# EAGLE design oc (EAGLE 7.2.0)
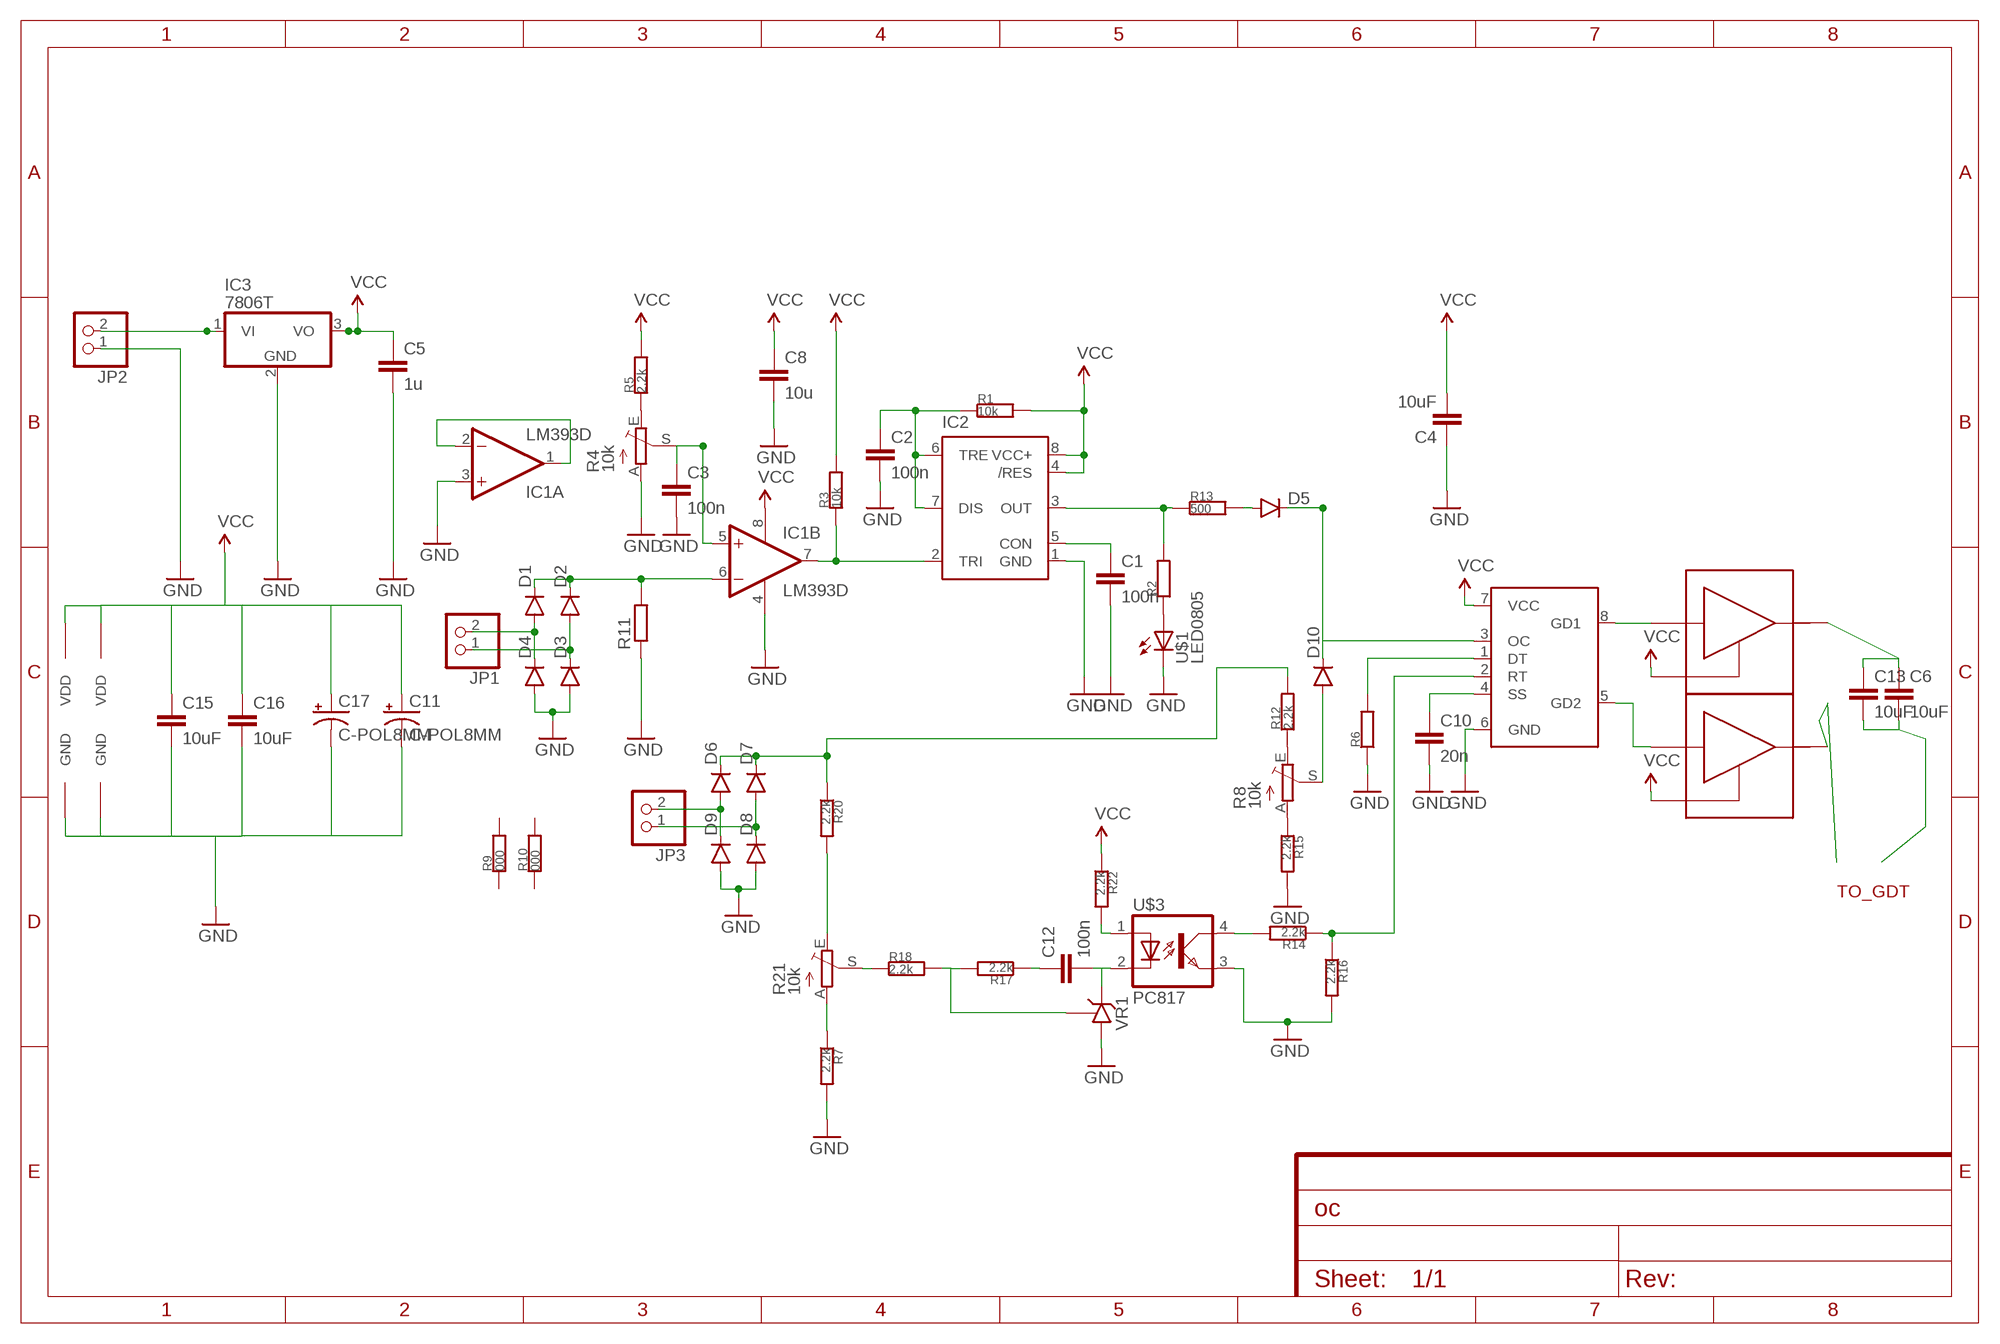
[diagram p0: schematic, sheet 1]

## Parts
C1  100n  CC0805  [C0805]
C2  100n  CC0805  [C0805]
C3  100n  CC0603  [C0603]
C4  10uF  10UF50V20%(1210)  [1210]
C5  1u  CC0805  [C0805]
C6  10uF  10UF50V20%(1210)  [1210]
C8  10u  CC0805  [C0805]
C10  20n  CC0805  [C0805]
C11  C-POL8MM  [PCAP8]
C12  100n  CC0805  [C0805]
C13  10uF  10UF50V20%(1210)  [1210]
C15  10uF  10UF50V20%(1210)  [1210]
C16  10uF  10UF50V20%(1210)  [1210]
C17  C-POL8MM  [PCAP8]
D1  PMLL4150  [SOD80C]
D2  PMLL4150  [SOD80C]
D3  PMLL4150  [SOD80C]
D4  PMLL4150  [SOD80C]
D5  PMLL4150  [SOD80C]
D6  PMLL4150  [SOD80C]
D7  PMLL4150  [SOD80C]
D8  PMLL4150  [SOD80C]
D9  PMLL4150  [SOD80C]
D10  PMLL4150  [SOD80C]
IC1  LM393D  [SO08]
IC2  NE555D  [SO08]
IC3  7806T  [TO220H]
JP1  PINHD-1X2  [1X02]
JP2  PINHD-1X2  [1X02]
JP3  PINHD-1X2  [1X02]
R1  10k  R0805  [R0805]
R2  R0805  [R0805]
R3  10k  R0805  [R0805]
R4  10k  TRIM_EU-RJ9W  [RJ9W]
R5  2.2k  R0805  [R0805]
R6  R0805  [R0805]
R7  2.2k  R0805  [R0805]
R8  10k  TRIM_EU-RJ9W  [RJ9W]
R9  000  R1206  [R1206]
R10  000  R0805  [R0805]
R11  R-EU_0617/17  [0617/17]
R12  2.2k  R0805  [R0805]
R13  500  R0805  [R0805]
R14  2.2k  R0805  [R0805]
R15  2.2k  R0805  [R0805]
R16  2.2k  R0805  [R0805]
R17  2.2k  R0805  [R0805]
R18  2.2k  R0805  [R0805]
R20  2.2k  R0805  [R0805]
R21  10k  TRIM_EU-RJ9W  [RJ9W]
R22  2.2k  R0805  [R0805]
U$1  LED0805  [0805-LED]
U$2  TPS92020  [SO08]
U$3  PC817  [DIL4-SMD]
U$7  IXDD614  [DPACK-5]
U$8  IXDD614  [DPACK-5]
VR1  TL431CLPSO8  [SO08]

## Nets
GND: C1.2 C2.2 C3.2 C4.1 C5.2 C8.2 C10.2 C11.P$2(-) C15.2 C16.2 C17.P$2(-) D3.A D4.A D8.A D9.A IC1.3(A:+IN) IC1.4(P:V-) IC2.1(GND) IC3.2(GND) JP2.1 R4.A R6.1 R7.2 R11.1 R15.2 R16.2 U$1.C U$2.6(GND) U$3.3(EMIT) U$7.3(GND) U$7.6(GND) U$8.3(GND) U$8.6(GND) VR1.2(A) VR1.3(A) VR1.6(A) VR1.7(A)
N$1: D1.C D2.C IC1.6(B:-IN) R11.2
N$2: U$2.8(GD1) U$8.4(IN)
N$3: C1.1 IC2.5(CON)
N$4: D5.C D10.C U$2.3(OC)
N$5: C2.1 IC2.6(TRE) IC2.7(DIS) R1.1
N$6: IC2.3(OUT) R2.2 R13.1
N$7: R2.1 U$1.A
N$8: IC1.7(B:OUT) IC2.2(TRI) R3.1
N$9: R4.E R5.1
N$10: C3.1 IC1.5(B:+IN) R4.S
N$11: IC1.1(A:OUT) IC1.2(A:-IN)
N$12: D2.A D3.C JP1.1
N$13: D1.A D4.C JP1.2
N$14: IC3.1(VI) JP2.2
N$15: U$2.5(GD2) U$7.4(IN)
N$16: D5.A R13.2
N$17: R8.E R12.1
N$18: C10.1 U$2.4(SS)
N$19: R6.2 U$2.1(DT)
N$20: R14.1 R16.1 U$2.2(RT)
N$21: R14.2 U$3.4(COL)
N$22: C6.1 C13.1 U$8.2(OUT)
N$23: U$7.2(OUT)
N$24: C6.2 C13.2
N$25: D6.C D7.C R12.2 R20.1
N$26: C12.2 U$3.2(C) VR1.1(C)
N$27: R17.2 R18.2 VR1.8(R)
N$28: C12.1 R17.1
N$29: R18.1 R21.S
N$30: R20.2 R21.E
N$31: D10.A R8.S
N$32: R22.2 U$3.1(A)
N$33: D7.A D8.C JP3.1
N$34: D6.A D9.C JP3.2
N$36: R8.A R15.1
N$37: R7.1 R21.A
VCC: C4.2 C5.1 C8.1 C11.P$1(+) C15.1 C16.1 C17.P$1(+) IC1.8(P:V+) IC2.4(/RES) IC2.8(VCC+) IC3.3(VO) R1.2 R3.2 R5.2 R22.1 U$2.7(VCC) U$7.1(VDD) U$7.5(EN) U$8.1(VDD) U$8.5(EN)
Unconnected: R9.1 R9.2 R10.1 R10.2

## Notes on the sheet
- TO_GDT

## Library data of the parts
C1-C3 C5 C8 C10 C12 = CasaLibrary:C: Capacitor
C4 C6 C13 C15 C16 = SparkFun-Capacitors:10UF50V20%(1210): CAP-09824; PROD_ID: CAP-09824
C11 C17 = CasaLibrary:C-POL
D1-D10 = DIODE:PMLL4150
IC1 = linear:LM393: COMPARATOR
IC2 = SparkFun-AnalogIC:NE555: General purpose bipolar Timer
IC3 = linear:78*: Positive VOLTAGE REGULATOR Source: http://cache.national.com/ds/LM/LM78L05.pdf http://www.fairchildsemi.com/ds/LM/LM7805.pdf
JP1-JP3 = pinhead:PINHD-1X2: PIN HEADER
R1-R3 R5-R7 R9 R10 R12-R18 R20 R22 = CasaLibrary:R
R4 R8 R21 = pot:TRIM_EU-: POTENTIOMETER
R11 = rcl:R-EU_: RESISTOR, European symbol
U$1 = CasaLibrary:LED
U$2 = CasaLibrary:TPS92020
U$3 = CasaLibrary:PC817
U$7 U$8 = CasaLibrary:IXDD614
VR1 = CasaLibrary:TL431CLP: VOLTAGE REGULATOR

## Board
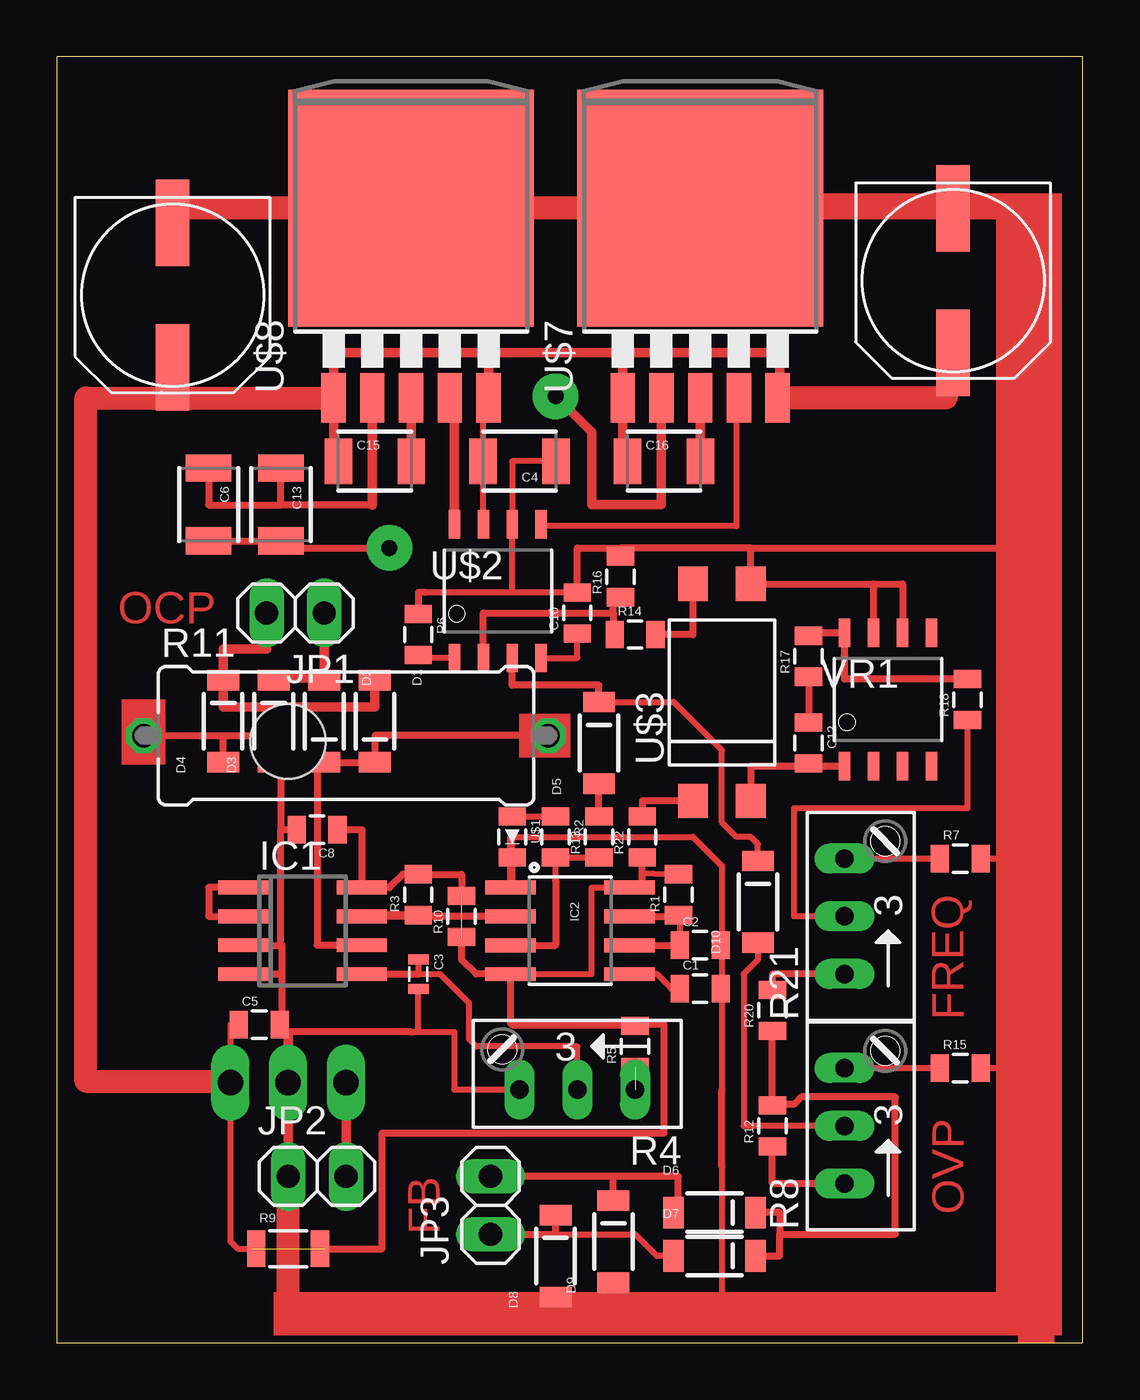
[diagram p1: board, top side]
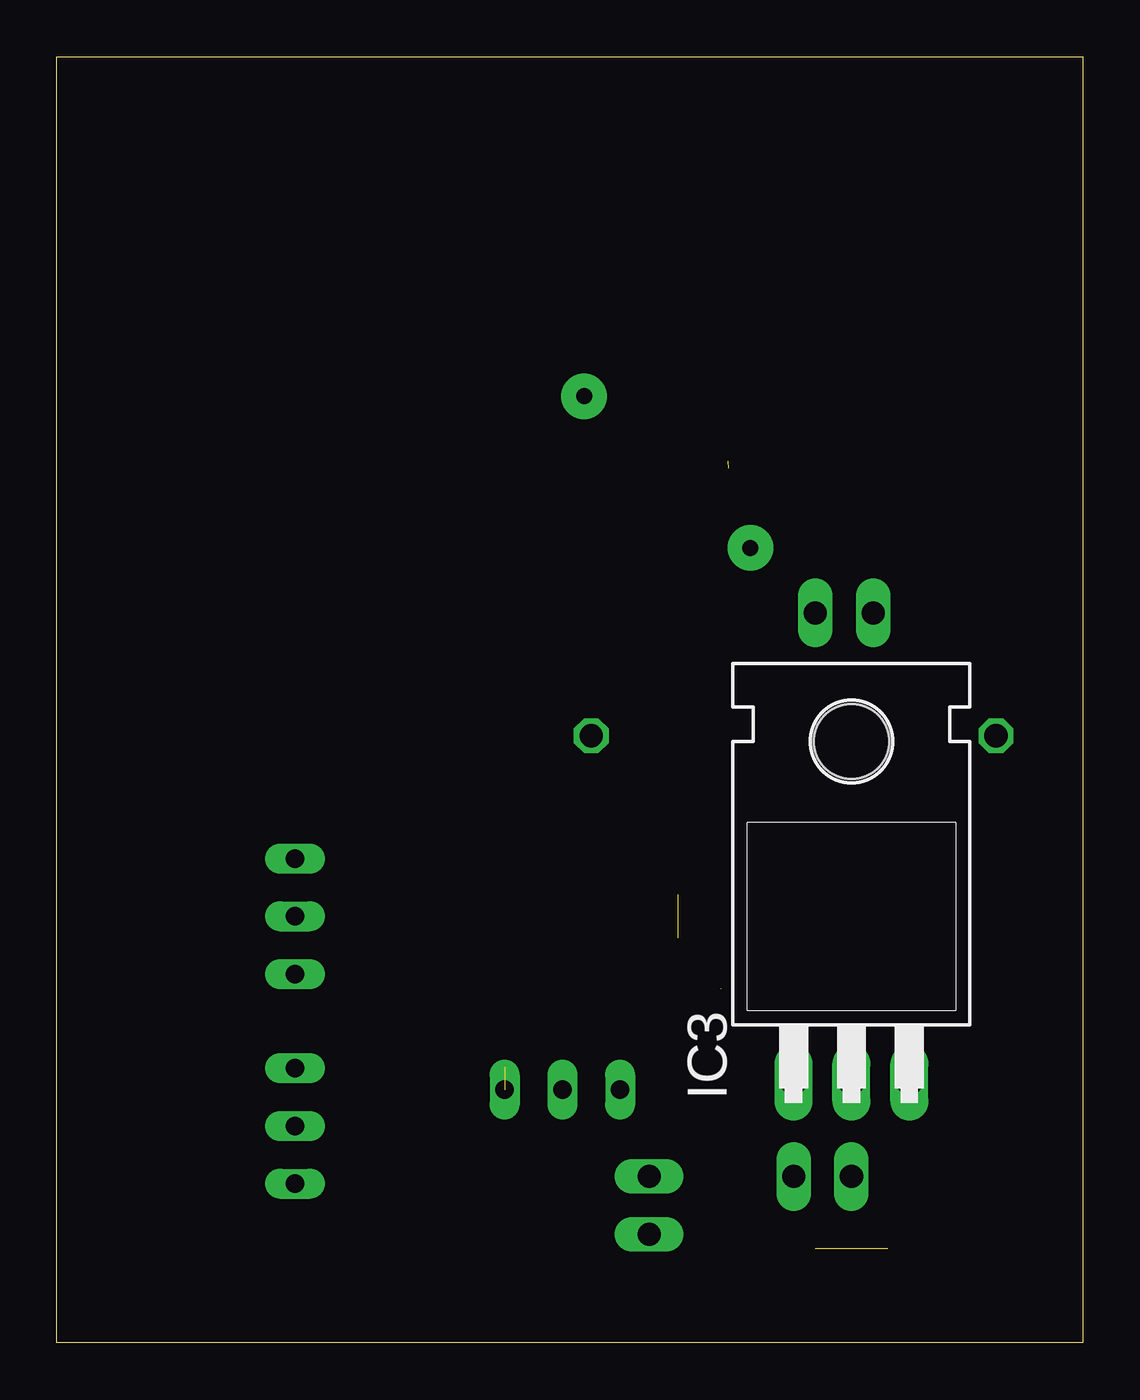
[diagram p2: board, bottom side, seen from below]

Size 45.06 x 56.5 mm. Coordinates in mm from the lower left corner, seen from the top.
Outline: 0,0 45.06,0 45.06,56.5 0,56.5 0,0
Copper layers (1*16): Top 0.035mm / dielectric 1.5mm / Bottom 0.035mm
Design rules "default": minimum track width 0.2mm, minimum drill 0.2mm, track to track 0.2mm, track to pad 0.2mm, pad to pad 0.2mm, via to via 0.2mm, smd to smd 0.2mm, copper to edge 0.2mm, drill to drill 0.2mm, minimum pad ring 10mil, minimum via ring 8mil, stop-mask expansion 4mil, vias tented up to drill 0mil, thermal gap 10mil

### Footprints (pad centres in the part's own frame; a part is rotated, then mirrored left to right if it is on the bottom)
C0805 = smd 0.8 x 1.2: 1 -0.9,0; 2 0.9,0
C0603 = smd 0.45 x 0.9: 1 -0.65,0; 2 0.65,0
1210 = smd 1.2 x 2: 1 -1.6,0; 2 1.6,0
PCAP8 = smd 3.8 x 1.46: P$1 -3.175,0; P$2 3.175,0
SOD80C = smd 0.9 x 1.4: A -1.8,0; C 1.8,0
SO08 = smd 0.6 x 2.2: 1 -1.905,-2.6; 2 -0.635,-2.6; 3 0.635,-2.6; 4 1.905,-2.6; 5 1.905,2.6; 6 0.635,2.6; 7 -0.635,2.6; 8 -1.905,2.6
SO08' = smd 0.61 x 2.21: 1 -1.905,-2.616; 2 -0.635,-2.616; 3 0.635,-2.616; 4 1.905,-2.616; 5 1.905,2.616; 6 0.635,2.616; 7 -0.635,2.616; 8 -1.905,2.616
TO220H = drill 1.118 long: 1 -2.54,-10.16; 2 0,-10.16; 3 2.54,-10.16 | hole 3.302: 0,4.826
1X02 = drill 1.016 long: 1 -1.27,0; 2 1.27,0
R0805 = smd 0.8 x 1.2: 1 -0.9,0; 2 0.9,0
RJ9W = drill 0.813 long: A 2.54,0.635; E -2.54,0.635; S 0,0.635
R1206 = smd 0.8 x 1.6: 1 -1.4,0; 2 1.4,0
0617/17 = drill 1.016 octagon: 1 -8.89,0; 2 8.89,0
0805-LED = smd 0.8 x 1.2: A -0.9,0; C 0.9,0
SO08'' = smd 0.5 x 1.25: 1 -1.905,-2.934; 2 -0.635,-2.934; 3 0.635,-2.934; 4 1.905,-2.934; 5 1.905,2.934; 6 0.635,2.934; 7 -0.635,2.934; 8 -1.905,2.934
DIL4-SMD = smd 1.3 x 1.5: 1 -1.27,-4.77; 2 1.27,-4.77; 3 1.27,4.77; 4 -1.27,4.77
DPACK-5 = smd 1.067 x 2.159: 1 -3.404,-8.331; 2 -1.702,-8.331; 3 0,-8.331; 4 1.702,-8.331; 5 3.404,-8.331 | smd 10.8 x 10.41: 6 0,0

### Placement (x,y rotation side)
C1  28.26,15.56 0 top
C2  28.26,17.46 0 top
C3  15.88,16.19 270 top
C4  20.32,38.73 180 top
C5  8.89,13.97 0 top
C6  6.67,36.83 270 top
C8  11.43,22.54 180 top
C10  22.86,32.07 90 top
C11  39.37,46.67 90 top
C12  33.02,26.35 270 top
C13  9.84,36.83 270 top
C15  13.97,38.73 0 top
C16  26.67,38.73 0 top
C17  5.08,46.04 90 top
D1  13.97,27.3 270 top
D2  11.75,27.3 270 top
D3  9.53,27.3 90 top
D4  7.3,27.3 90 top
D5  23.81,26.35 90 top
D6  28.89,5.71 0 top
D7  28.89,3.81 0 top
D8  21.91,3.81 90 top
D9  24.45,4.45 90 top
D10  30.8,19.37 90 top
IC1  10.79,18.1 270 top
IC2  [SO08']  22.54,18.1 270 top
IC3  10.16,21.59 0 bottom
JP1  10.48,32.07 180 top
JP2  11.43,7.3 0 top
JP3  19.05,6.03 90 top
R1  27.3,19.68 90 top
R2  21.91,22.23 270 top
R3  15.88,19.68 90 top
R4  22.86,11.75 180 top
R5  25.4,13.02 90 top
R6  15.88,31.11 270 top
R7  39.69,21.27 0 top
R8  35.24,9.53 90 top
R9  10.16,4.13 0 top
R10  17.78,18.73 90 top
R11  12.7,26.67 0 top
R12  31.43,9.53 90 top
R13  23.81,22.23 90 top
R14  25.4,31.11 0 top
R15  39.69,12.06 0 top
R16  24.77,33.66 90 top
R17  33.02,30.16 90 top
R18  40.01,28.26 90 top
R20  31.43,14.61 90 top
R21  35.24,18.73 90 top
R22  25.72,22.23 90 top
U$1  20,22.23 270 top
U$2  TPS92020  [SO08'']  19.37,33.02 0 top
U$3  29.21,28.57 0 top
U$4  [A5P-LOC]  -20.64,124.14 0 top  (outside the outline)
U$7  28.26,49.85 0 top
U$8  15.56,49.85 0 top
VR1  [SO08'']  36.51,28.26 0 top

### Tracks (layer width: path | path; a pad name or v marks a point on that pad's centre or on a via)
GND  (2 unrouted)
  Top 0.254: U$1.C 20,22.23 | 20,22.23 19.93,22.23 IC2.1 | R4.A 17.45,11.11 17.46,11.13 17.46,13.65 15.88,13.65 | 15.88,13.65 15.56,13.65 9.84,13.65 9.84,13.97 C5.2 | 15.88,13.65 15.88,15.56 | 15.89,32 R6.1 | C10.2 20,32.97 | 20,32.97 U$2.6 20,38.73 C4.1 | 20,32.97 16.2,32.97 | 29.21,15.56 29.21,17.46 C2.2 29.21,17.52 29.21,20.95 27.94,22.23 20,22.23 | 29.21,15.56 29.21,11.11 | 29.21,7.72 29.21,1.59 | C1.2 29.21,15.56 | R15.2 41.91,12.06 | R7.2 41.91,21.27 41.91,20.95
  Top 0.305: IC1.4 9.89,16.19 | 9.89,16.19 9.89,17.46 9.84,17.46 | 9.89,16.19 9.89,13.65 15.56,13.65 | IC1.3 9.84,17.46 | 9.84,22.54 C8.2 | 9.84,17.46 9.84,22.54 | D4.A 7.3,26.67 | 7.3,26.67 9.53,26.67 D3.A 9.84,25.5 9.84,22.54 | IC2.1 20,20 U$1.C | R11.1 7.3,26.67 | C10.2 22.86,34.92 24.77,34.92 | 24.77,34.92 R16.2 | 30.48,34.92 U$3.3 35.88,33.34 | 30.48,34.92 24.77,34.92 | 30.48,34.92 41.91,34.92 | 35.88,33.34 37.15,33.34 VR1.6 | VR1.7 35.88,33.34 | 42.23,12.06 42.23,1.59 | 16.2,32.97 15.88,32.97 R6.1 | 29.21,7.72 29.21,11.11 | D8.A 24.45,1.59 D9.A
  Top 0.406: C17.P$2 5.08,49.85 U$8.6 U$7.6 | 15.56,38.43 U$8.3 | C16.2 arc-90 28.26,38.75 U$7.3 | JP2.1 IC3.2 10.16,13.6 C5.2
  Top 1.016: 5.08,49.85 U$7.6 C11.P$2 41.91,49.85 41.91,34.92 41.91,20.95 41.91,12.06 42.23,1.59 29.21,1.59 24.45,1.59 10.16,1.59 JP2.1
N$1
  Top 0.305: IC1.6 11.43,17.46 11.43,25.5 D2.C D1.C 13.97,26.67 R11.2
N$2
  Top 0.406: U$2.8 17.46,41.52 U$8.4
N$3
  Top 0.254: C1.1 26.99,15.56 26.35,16.19 IC2.5
N$4
  Top 0.254: D10.C 30.8,21.91 30.48,22.23 29.84,22.23 29.21,22.86 29.21,26.04 27.09,28.15 D5.C
  Top 0.305: D5.C 23.81,28.89 20,28.89 U$2.3
N$5
  Top 0.254: 27.36,18.73 C2.1
  Top 0.305: 25.08,18.73 IC2.7 | IC2.7 27.3,18.73 R1.1 | IC2.6 C2.1 | IC2.7 27.36,18.73
N$6
  Top 0.254: R13.1 R2.2 21.91,20.32
  Top 0.305: IC2.3 21.91,17.46 21.91,20.32
N$7
  Top 0.254: U$1.A R2.1
N$8
  Top 0.305: IC2.2 13.97,18.73 | 13.97,18.73 IC1.7 | R3.1 13.97,18.79 13.97,18.73
N$9  (1 unrouted)
N$10
  Top 0.254: C3.1 15.88,16.19 16.83,16.19 18.1,14.92 18.1,13.34 18.41,13.02 22.86,13.02 R4.S
  Top 0.305: IC1.5 15.88,16.19
N$11
  Top 0.305: IC1.1 6.67,20 6.67,18.73 IC1.2
N$12
  Top 0.305: 9.53,29.21 D3.C | D2.A 11.75,29.21
  Top 0.406: 9.53,29.21 11.75,29.21 JP1.1
N$13
  Top 0.305: 13.97,29.21 D1.A
  Top 0.406: 13.97,29.21 13.97,27.94 7.3,27.94 D4.C 7.3,30.48 9.21,30.48 JP1.2
N$14
  Top 0.406: JP2.2 IC3.1
N$15
  Top 0.254: U$7.4 29.84,41.52 29.84,35.88 21.27,35.88 U$2.5
N$16
  Top 0.305: R13.2 D5.A
N$17
  Top 0.305: R8.E 31.43,6.99 R12.1
N$18
  Top 0.254: U$2.4 22.86,30.09 C10.1
N$19
  Top 0.254: U$2.1 15.88,30.09 R6.2
N$20
  Top 0.305: U$2.2 18.73,32.07 24.45,32.07 | 24.45,32.07 24.45,33.02 R16.1 | 24.45,32.07 24.45,31.43 R14.1
N$21
  Top 0.305: U$3.4 27.94,31.11 R14.2
N$22
  Top 0.305: 13.86,36.82 9.84,36.82 | 9.84,36.82 C13.1 | C6.1 6.67,36.82 9.84,36.82
  Top 0.406: 13.97,41.52 U$8.2 13.86,36.82
N$23  (via drill 0.7 pad 2)
  Top 0.406: U$7.2 26.56,36.83 23.5,36.83 23.5,40.01 v21.91,41.59
N$24
  Top 0.305: C6.2 C13.2 10.16,34.92 14.61,34.92
N$25
  Top 0.305: R20.1 R12.2 31.48,10.48 32.38,10.48 32.7,10.79 36.83,10.79 36.83,4.76 31.75,4.76 | D7.C 31.75,3.81 31.75,4.76 | D6.C 31.75,5.71 31.75,4.76
N$26
  Top 0.305: VR1.1 32.7,25.32 | 32.7,25.32 30.48,25.32 U$3.2 | C12.2 32.7,25.32
N$27
  Top 0.305: R17.2 32.7,31.19 VR1.8 34.61,29.16 R18.2
N$28
  Top 0.305: R17.1 C12.1
N$29
  Top 0.254: R21.S 32.38,18.73 32.38,23.5 40.01,23.5 R18.1
N$30
  Top 0.305: R21.E 31.43,16.19 R20.2
N$31
  Top 0.254: R8.S 30.16,9.53 30.16,16.19 30.8,16.83 D10.A
N$32
  Top 0.305: U$3.1 25.72,23.8 R22.2
N$33
  Top 0.254: 21.91,4.76 25.4,4.76 26.35,3.81 D7.A
  Top 0.305: JP3.1 21.91,4.76 D8.C
N$34
  Top 0.305: D6.A 27.3,5.71 27.3,7.3 24.45,7.3 | 24.45,7.3 JP3.2 | D9.C 24.45,7.3
N$35  (via drill 0.7 pad 2)
  other vias: 14.61,34.92
N$36
  Top 0.254: R8.A R15.1
N$37
  Top 0.254: R21.A R7.1
VCC  (2 unrouted)
  Top 0.254: 27.36,20.64 R1.2 25.72,20.64 | 26.67,13.97 25.4,13.97 | 25.4,13.97 21.64,13.97 | IC2.4 23.5,16.19 23.5,20 IC2.8 25.72,20 | R5.2 25.4,13.97 | U$2.7 18.73,38.42 | 18.73,38.42 18.73,41.29 U$8.5 | C4.2 18.73,38.42 | C5.1 7.62,13.97 IC3.3 7.62,4.45 7.94,4.13 8.57,4.13
  Top 0.305: IC1.8 13.65,20 | IC1.8 14.61,20 15.19,20.59 R3.2 17.78,20.59 17.78,19.68 | 17.78,17.78 17.78,16.83 18.41,16.19 IC2.4 19.93,14.05 20,13.97 25.4,13.97 | C8.1 13.39,22.54 IC1.8 | 25.72,20 25.72,20.64 R22.1 | 11.75,4.13 14.29,4.13 14.29,9.21 26.67,9.21 26.67,13.97
  Top 0.406: 24.85,41.59 U$7.1 | U$8.1 12.06,41.52 12.06,41.27 | U$8.1 12.15,43.5 18.96,43.5 | 18.96,43.5 24.85,43.5 | 24.85,43.5 31.75,43.5 31.75,41.52 U$7.5 | U$7.1 24.85,43.5 | U$8.5 18.96,43.5 | C16.1 arc-90 24.85,38.95 U$7.1 | C15.1 arc-90 12.15,38.63 U$8.1
  Top 1.016: 5.08,41.52 1.27,41.52 1.27,11.48 7.62,11.48 IC3.3 | 5.08,41.52 U$8.1 | C11.P$1 39.05,41.52 U$7.5 | C17.P$1 5.08,41.52
(copper drawn outside any net)
  shapes: Top area x9

### Text on the board
Top: OCP | FREQ | OVP | FB